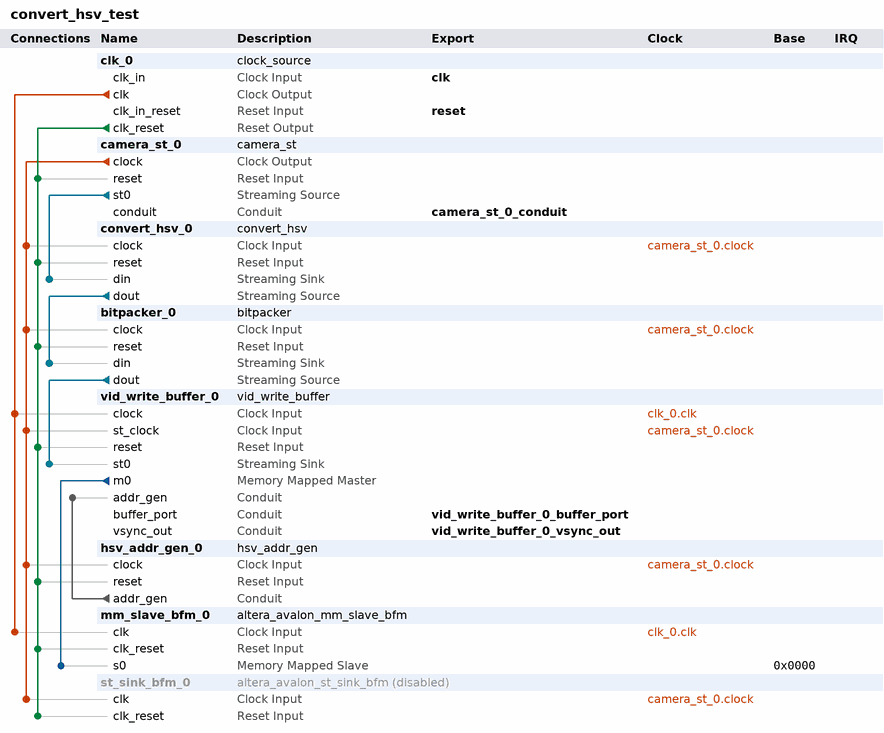
[diagram p0: system contents]
# Platform Designer (Qsys) system convert_hsv_test, Cyclone IV GX EP4CGX150DF31C7
# Parameters at their usual value, and those the tool derives, are not listed.
package require -exact qsys 15.0
create_system convert_hsv_test
set_project_property DEVICE_FAMILY {Cyclone IV GX}
set_project_property DEVICE EP4CGX150DF31C7

add_instance clk_0 clock_source 15.0
set_instance_parameter_value clk_0 clockFrequency 100000000

add_instance camera_st_0 camera_st 1.0
set_instance_parameter_value camera_st_0 DATA_WIDTH 24

add_instance convert_hsv_0 convert_hsv 1.0
set_instance_parameter_value convert_hsv_0 PIPELINE 16

add_instance bitpacker_0 bitpacker 1.0
set_instance_parameter_value bitpacker_0 PACK_LENGTH 8

add_instance vid_write_buffer_0 vid_write_buffer 2.0
set_instance_parameter_value vid_write_buffer_0 AV_ADDR_WIDTH 22
set_instance_parameter_value vid_write_buffer_0 BANK 0
set_instance_parameter_value vid_write_buffer_0 DATA_WIDTH 8
set_instance_parameter_value vid_write_buffer_0 FIFO_LENGTH_LOG_2 6
set_instance_parameter_value vid_write_buffer_0 FRAME_PIXELS 38400
set_instance_parameter_value vid_write_buffer_0 ST_ADDR_WIDTH 16

add_instance hsv_addr_gen_0 hsv_addr_gen 1.0
set_instance_parameter_value hsv_addr_gen_0 ADDR_BASE 0
set_instance_parameter_value hsv_addr_gen_0 ADDR_WIDTH 16
set_instance_parameter_value hsv_addr_gen_0 HEIGHT 480
set_instance_parameter_value hsv_addr_gen_0 WIDTH 640

add_instance mm_slave_bfm_0 altera_avalon_mm_slave_bfm 15.0
set_instance_parameter_value mm_slave_bfm_0 ADDRESS_UNITS WORDS
set_instance_parameter_value mm_slave_bfm_0 ASSERT_HIGH_ARBITERLOCK 1
set_instance_parameter_value mm_slave_bfm_0 ASSERT_HIGH_BYTEENABLE 1
set_instance_parameter_value mm_slave_bfm_0 ASSERT_HIGH_LOCK 1
set_instance_parameter_value mm_slave_bfm_0 ASSERT_HIGH_READ 1
set_instance_parameter_value mm_slave_bfm_0 ASSERT_HIGH_READDATAVALID 1
set_instance_parameter_value mm_slave_bfm_0 ASSERT_HIGH_RESET 1
set_instance_parameter_value mm_slave_bfm_0 ASSERT_HIGH_WAITREQUEST 1
set_instance_parameter_value mm_slave_bfm_0 ASSERT_HIGH_WRITE 1
set_instance_parameter_value mm_slave_bfm_0 AV_ADDRESS_W 16
set_instance_parameter_value mm_slave_bfm_0 AV_BURSTCOUNT_W 3
set_instance_parameter_value mm_slave_bfm_0 AV_BURST_BNDR_ONLY 1
set_instance_parameter_value mm_slave_bfm_0 AV_BURST_LINEWRAP 1
set_instance_parameter_value mm_slave_bfm_0 AV_FIX_READ_LATENCY 0
set_instance_parameter_value mm_slave_bfm_0 AV_MAX_PENDING_READS 1
set_instance_parameter_value mm_slave_bfm_0 AV_MAX_PENDING_WRITES 0
set_instance_parameter_value mm_slave_bfm_0 AV_NUMSYMBOLS 4
set_instance_parameter_value mm_slave_bfm_0 AV_READRESPONSE_W 8
set_instance_parameter_value mm_slave_bfm_0 AV_READ_WAIT_TIME 1
set_instance_parameter_value mm_slave_bfm_0 AV_REGISTERINCOMINGSIGNALS 0
set_instance_parameter_value mm_slave_bfm_0 AV_SYMBOL_W 8
set_instance_parameter_value mm_slave_bfm_0 AV_WRITERESPONSE_W 8
set_instance_parameter_value mm_slave_bfm_0 AV_WRITE_WAIT_TIME 0
set_instance_parameter_value mm_slave_bfm_0 REGISTER_WAITREQUEST 0
set_instance_parameter_value mm_slave_bfm_0 USE_ADDRESS 1
set_instance_parameter_value mm_slave_bfm_0 USE_ARBITERLOCK 0
set_instance_parameter_value mm_slave_bfm_0 USE_BEGIN_BURST_TRANSFER 0
set_instance_parameter_value mm_slave_bfm_0 USE_BEGIN_TRANSFER 0
set_instance_parameter_value mm_slave_bfm_0 USE_BURSTCOUNT 0
set_instance_parameter_value mm_slave_bfm_0 USE_BYTE_ENABLE 1
set_instance_parameter_value mm_slave_bfm_0 USE_CLKEN 0
set_instance_parameter_value mm_slave_bfm_0 USE_DEBUGACCESS 0
set_instance_parameter_value mm_slave_bfm_0 USE_LOCK 0
set_instance_parameter_value mm_slave_bfm_0 USE_READ 0
set_instance_parameter_value mm_slave_bfm_0 USE_READRESPONSE 0
set_instance_parameter_value mm_slave_bfm_0 USE_READ_DATA 0
set_instance_parameter_value mm_slave_bfm_0 USE_READ_DATA_VALID 0
set_instance_parameter_value mm_slave_bfm_0 USE_TRANSACTIONID 0
set_instance_parameter_value mm_slave_bfm_0 USE_WAIT_REQUEST 1
set_instance_parameter_value mm_slave_bfm_0 USE_WRITE 1
set_instance_parameter_value mm_slave_bfm_0 USE_WRITERESPONSE 0
set_instance_parameter_value mm_slave_bfm_0 USE_WRITE_DATA 1
set_instance_parameter_value mm_slave_bfm_0 VHDL_ID 0

add_instance st_sink_bfm_0 altera_avalon_st_sink_bfm 15.0
set_instance_property st_sink_bfm_0 ENABLED false
set_instance_parameter_value st_sink_bfm_0 ST_CHANNEL_W 1
set_instance_parameter_value st_sink_bfm_0 ST_ERROR_W 1
set_instance_parameter_value st_sink_bfm_0 ST_MAX_CHANNELS 1
set_instance_parameter_value st_sink_bfm_0 ST_NUMSYMBOLS 1
set_instance_parameter_value st_sink_bfm_0 ST_READY_LATENCY 0
set_instance_parameter_value st_sink_bfm_0 ST_SYMBOL_W 8
set_instance_parameter_value st_sink_bfm_0 USE_CHANNEL 0
set_instance_parameter_value st_sink_bfm_0 USE_EMPTY 0
set_instance_parameter_value st_sink_bfm_0 USE_ERROR 0
set_instance_parameter_value st_sink_bfm_0 USE_PACKET 1
set_instance_parameter_value st_sink_bfm_0 USE_READY 0
set_instance_parameter_value st_sink_bfm_0 USE_VALID 1
set_instance_parameter_value st_sink_bfm_0 VHDL_ID 0

# connections
add_connection camera_st_0.clock bitpacker_0.clock clock
add_connection camera_st_0.clock convert_hsv_0.clock clock
add_connection camera_st_0.clock hsv_addr_gen_0.clock clock
add_connection camera_st_0.clock st_sink_bfm_0.clk clock
add_connection camera_st_0.clock vid_write_buffer_0.st_clock clock
add_connection clk_0.clk mm_slave_bfm_0.clk clock
add_connection clk_0.clk vid_write_buffer_0.clock clock
add_connection clk_0.clk_reset bitpacker_0.reset reset
add_connection clk_0.clk_reset camera_st_0.reset reset
add_connection clk_0.clk_reset convert_hsv_0.reset reset
add_connection clk_0.clk_reset hsv_addr_gen_0.reset reset
add_connection clk_0.clk_reset mm_slave_bfm_0.clk_reset reset
add_connection clk_0.clk_reset st_sink_bfm_0.clk_reset reset
add_connection clk_0.clk_reset vid_write_buffer_0.reset reset
add_connection vid_write_buffer_0.m0 mm_slave_bfm_0.s0 avalon
set_connection_parameter_value vid_write_buffer_0.m0/mm_slave_bfm_0.s0 baseAddress 0x0000
add_connection bitpacker_0.dout vid_write_buffer_0.st0 avalon_streaming
add_connection camera_st_0.st0 convert_hsv_0.din avalon_streaming
add_connection convert_hsv_0.dout bitpacker_0.din avalon_streaming
add_connection hsv_addr_gen_0.addr_gen vid_write_buffer_0.addr_gen conduit

# exported interfaces
add_interface camera_st_0_conduit conduit end
set_interface_property camera_st_0_conduit EXPORT_OF camera_st_0.conduit
add_interface clk clock sink
set_interface_property clk EXPORT_OF clk_0.clk_in
add_interface reset reset sink
set_interface_property reset EXPORT_OF clk_0.clk_in_reset
add_interface vid_write_buffer_0_buffer_port conduit end
set_interface_property vid_write_buffer_0_buffer_port EXPORT_OF vid_write_buffer_0.buffer_port
add_interface vid_write_buffer_0_vsync_out conduit end
set_interface_property vid_write_buffer_0_vsync_out EXPORT_OF vid_write_buffer_0.vsync_out

set_interconnect_requirement {$system} qsys_mm.clockCrossingAdapter HANDSHAKE
set_interconnect_requirement {$system} qsys_mm.enableEccProtection FALSE
set_interconnect_requirement {$system} qsys_mm.insertDefaultSlave FALSE
set_interconnect_requirement {$system} qsys_mm.maxAdditionalLatency 1

save_system convert_hsv_test.qsys
